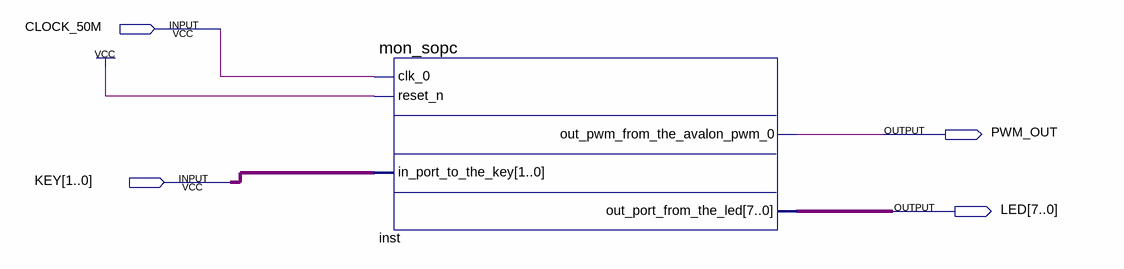
[diagram p0: schematic sheet]
// Quartus schematic sopc_pwm.bdf as structural Verilog: 1 symbols, 4 pins
module sopc_pwm (
  input  CLOCK_50M,
  input  [1:0] KEY,
  output PWM_OUT,
  output [7:0] LED
);

  mon_sopc inst (
    .clk_0(CLOCK_50M), .reset_n(1'b1), .in_port_to_the_key(KEY), .out_pwm_from_the_avalon_pwm_0(PWM_OUT),
    .out_port_from_the_led(LED));
endmodule
